# Altium schematic sheet overview.SchDoc
size A4; SheetNumber: 1; SheetTotal: 3
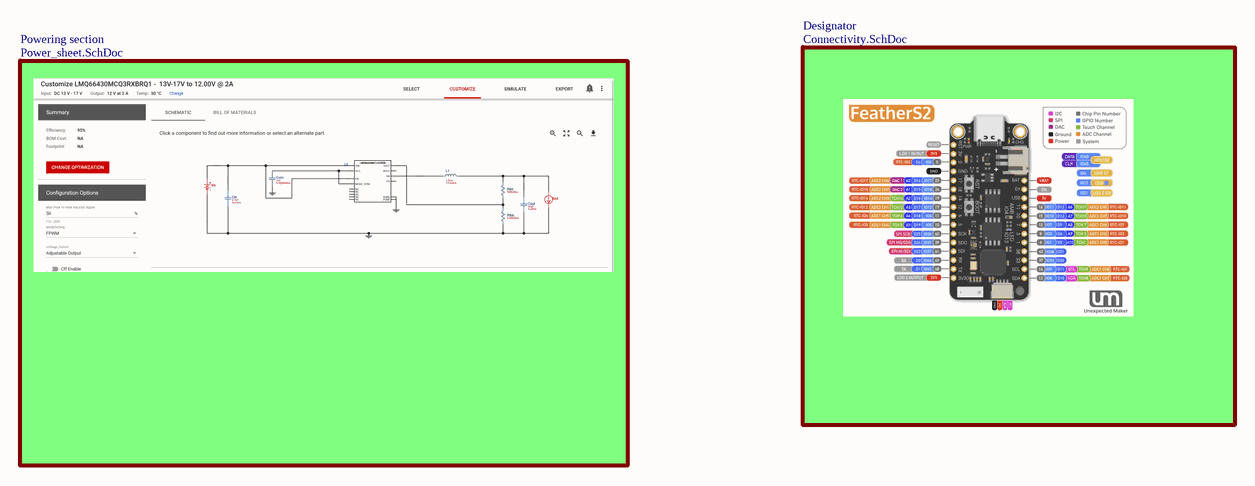
[diagram p0: overview.SchDoc]

## Sub-sheets
Designator = Connectivity.SchDoc: no entries
Powering section = Power_sheet.SchDoc: no entries